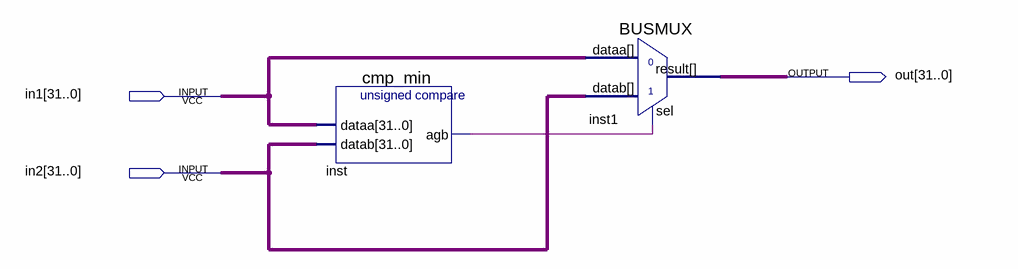
[diagram p0: schematic sheet]
// Quartus schematic min.bdf as structural Verilog: 2 symbols, 3 pins
module min (
  input  [31:0] in1,
  input  [31:0] in2,
  output [31:0] out
);

  wire inst_agb;

  cmp_min inst (.dataa(in1), .datab(in2), .agb(inst_agb));
  BUSMUX inst1 (.datab(in2), .sel(inst_agb), .dataa(in1), .result(out));
endmodule
